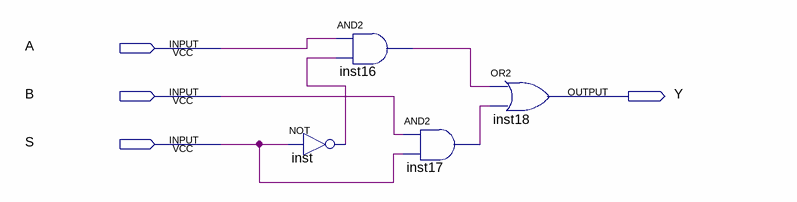
[diagram p0: schematic sheet]
// Quartus schematic MUX2.bdf as structural Verilog: 4 symbols, 4 pins
module MUX2 (
  input  A,
  input  B,
  input  S,
  output Y
);

  wire inst16_out, inst17_out, inst_out;

  not inst (inst_out, S);
  and inst16 (inst16_out, A, inst_out);
  and inst17 (inst17_out, B, S);
  or inst18 (Y, inst16_out, inst17_out);
endmodule
